# Altium schematic sheet Amplifiers_DAC.SchDoc
size 508 x 482 mm
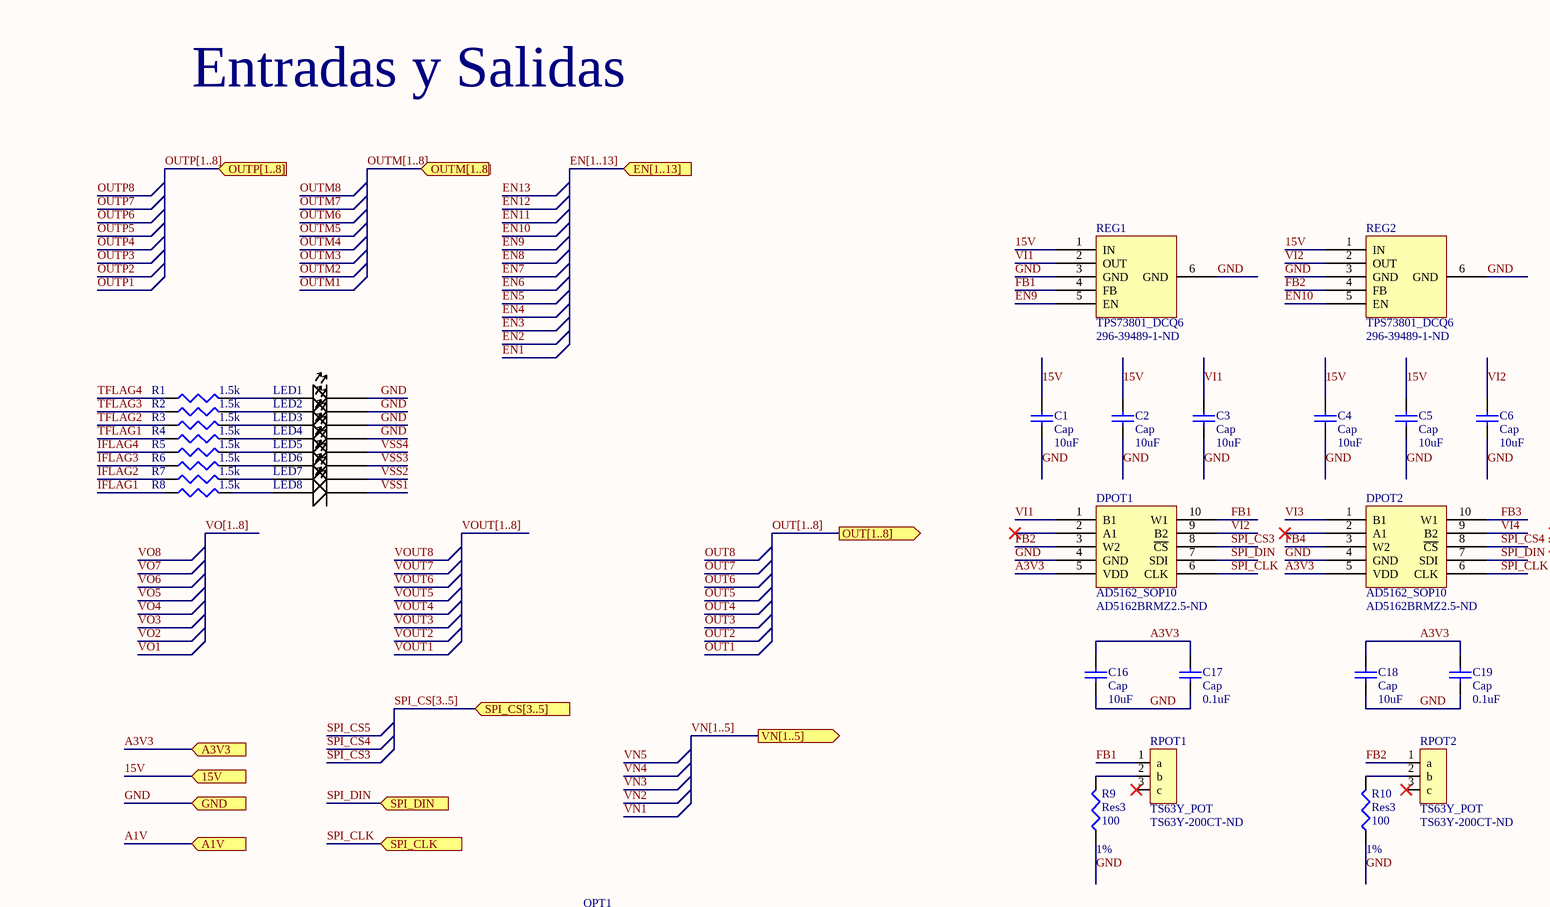
[diagram p0: Amplifiers_DAC.SchDoc, top left]
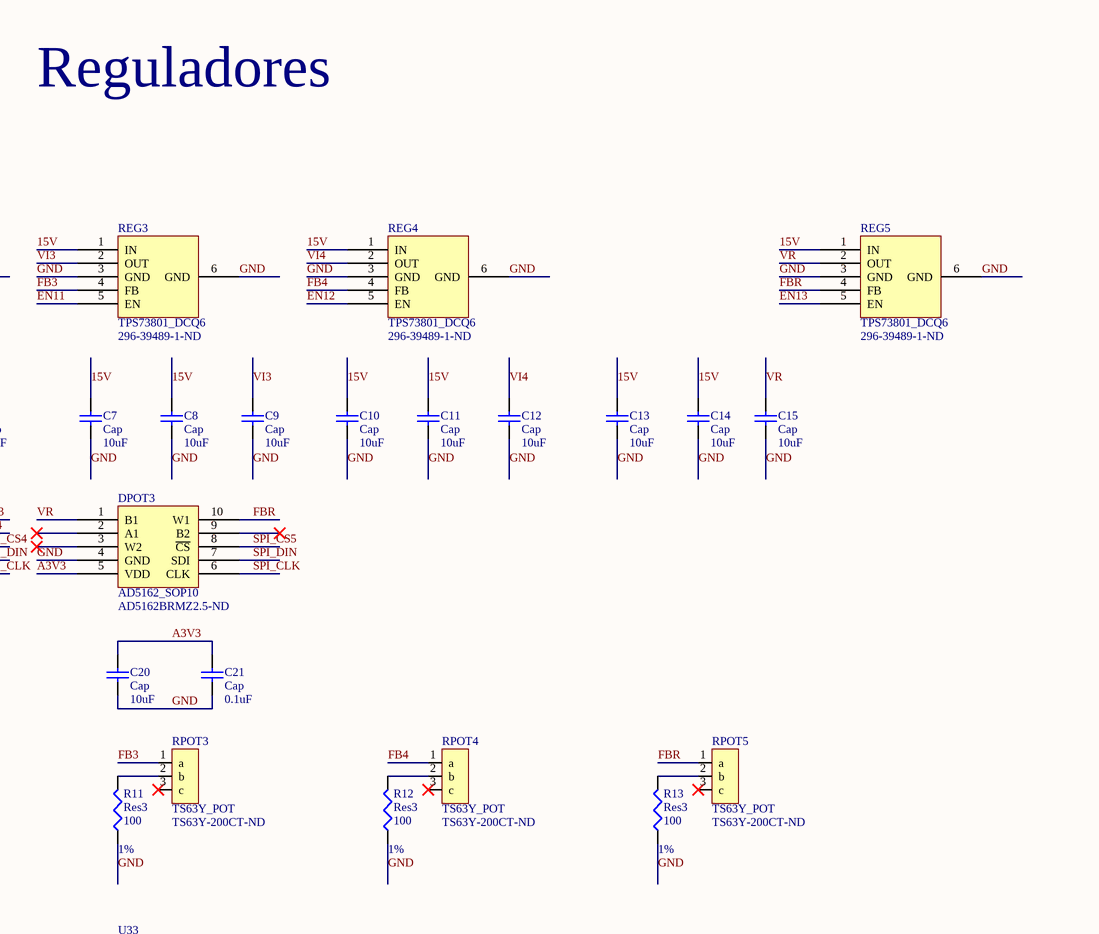
[diagram p1: Amplifiers_DAC.SchDoc, top right]
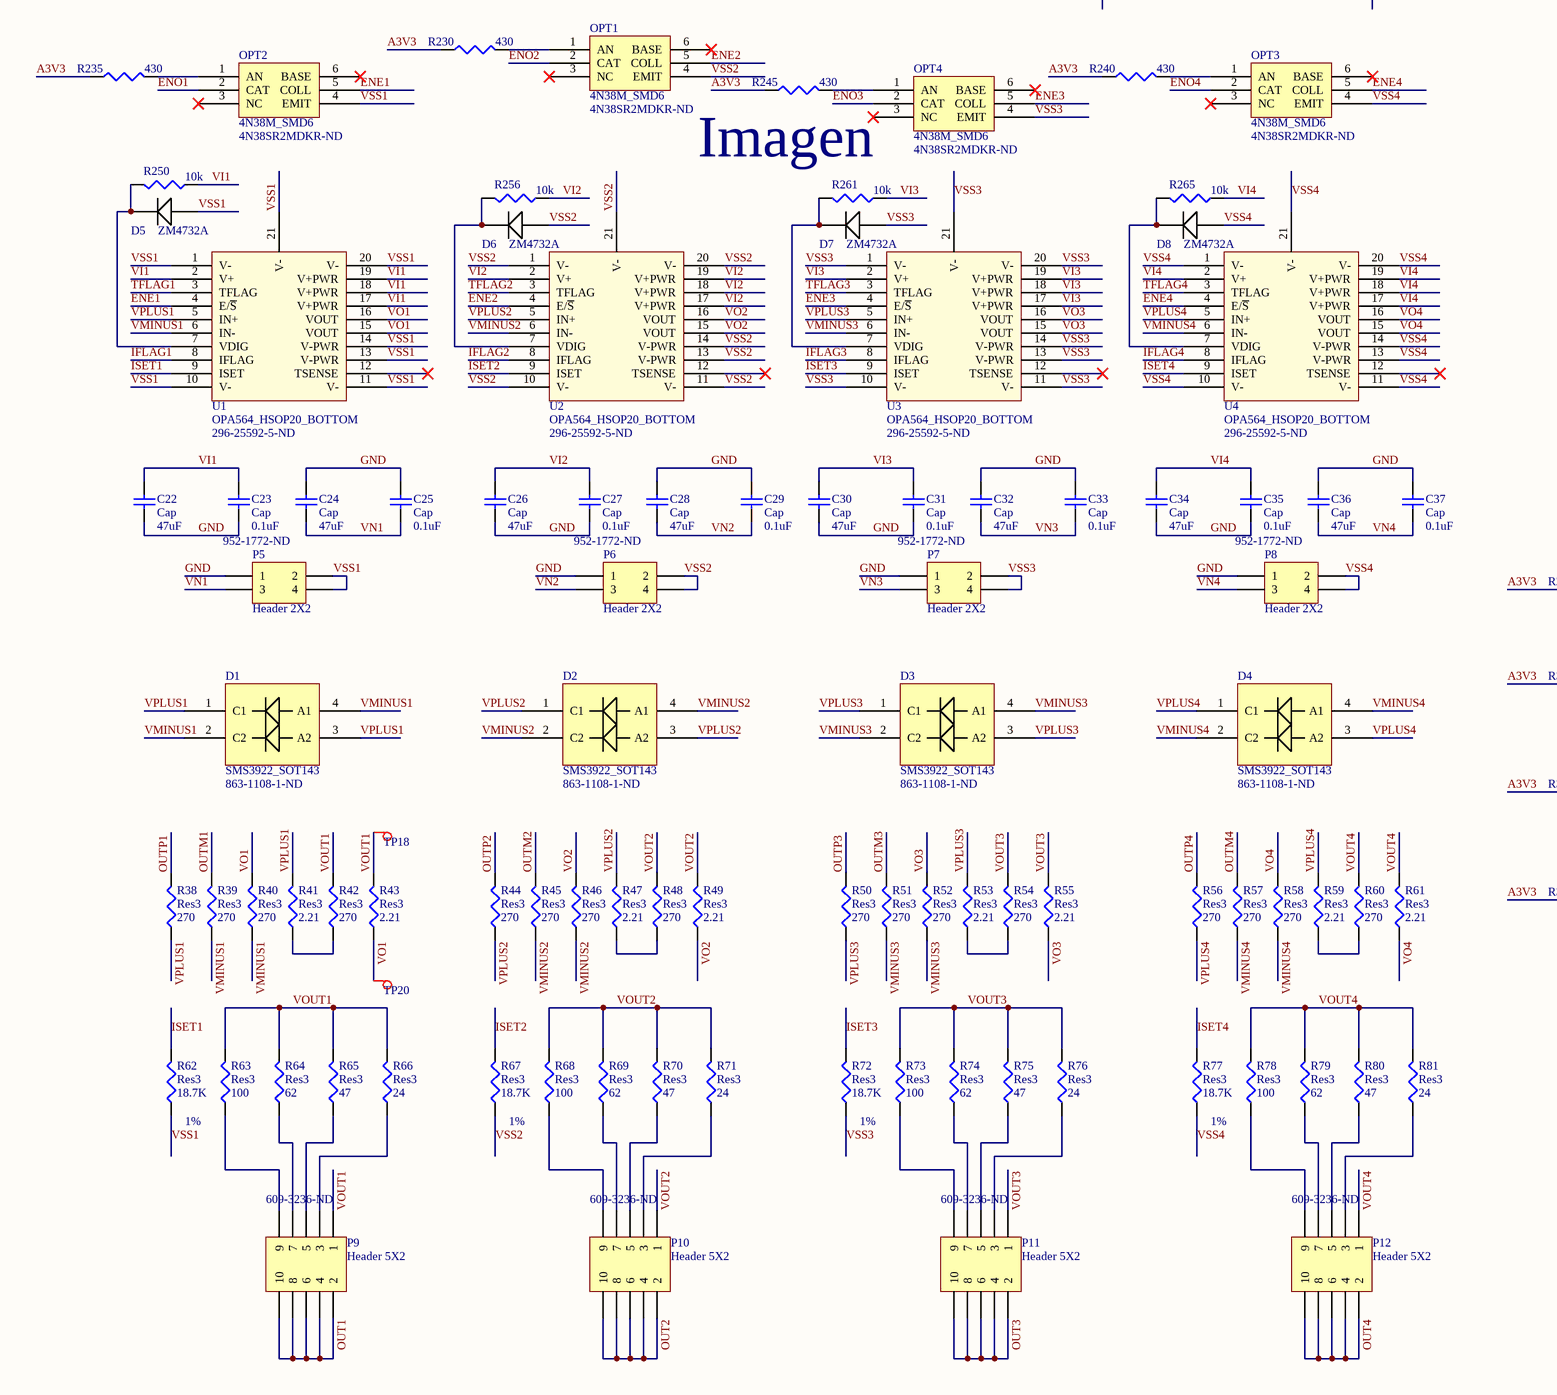
[diagram p2: Amplifiers_DAC.SchDoc, bottom left]
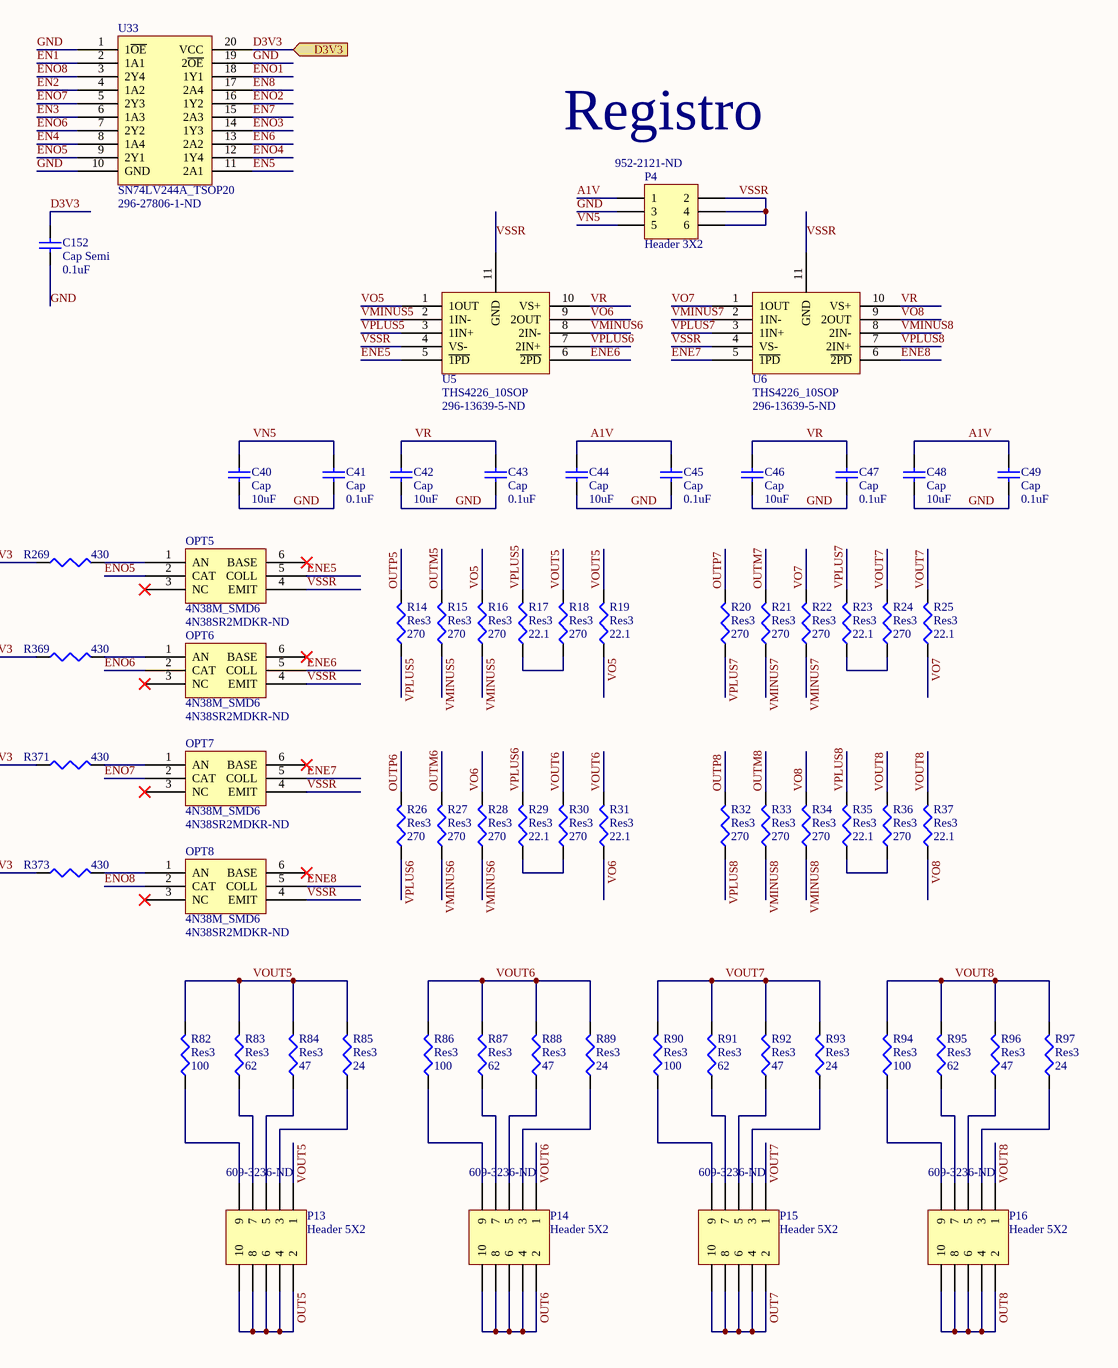
[diagram p3: Amplifiers_DAC.SchDoc, bottom right]

## Parts
C1  Cap  value 10uF  [RES_0805]
C2  Cap  value 10uF  [RES_0805]
C3  Cap  value 10uF  [RES_0805]
C4  Cap  value 10uF  [RES_0805]
C5  Cap  value 10uF  [RES_0805]
C6  Cap  value 10uF  [RES_0805]
C7  Cap  value 10uF  [RES_0805]
C8  Cap  value 10uF  [RES_0805]
C9  Cap  value 10uF  [RES_0805]
C10  Cap  value 10uF  [RES_0805]
C11  Cap  value 10uF  [RES_0805]
C12  Cap  value 10uF  [RES_0805]
C13  Cap  value 10uF  [RES_0805]
C14  Cap  value 10uF  [RES_0805]
C15  Cap  value 10uF  [RES_0805]
C16  Cap  value 10uF  [RES_0805]
C17  Cap  value 0.1uF  [J1-0603]
C18  Cap  value 10uF  [RES_0805]
C19  Cap  value 0.1uF  [J1-0603]
C20  Cap  value 10uF  [RES_0805]
C21  Cap  value 0.1uF  [J1-0603]
C22  Cap  value 47uF  [RES_1206]
C23  Cap  value 0.1uF  [J1-0603]
C24  Cap  value 47uF  [RES_1206]
C25  Cap  value 0.1uF  [J1-0603]
C26  Cap  value 47uF  [RES_1206]
C27  Cap  value 0.1uF  [J1-0603]
C28  Cap  value 47uF  [RES_1206]
C29  Cap  value 0.1uF  [J1-0603]
C30  Cap  value 47uF  [RES_1206]
C31  Cap  value 0.1uF  [J1-0603]
C32  Cap  value 47uF  [RES_1206]
C33  Cap  value 0.1uF  [J1-0603]
C34  Cap  value 47uF  [RES_1206]
C35  Cap  value 0.1uF  [J1-0603]
C36  Cap  value 47uF  [RES_1206]
C37  Cap  value 0.1uF  [J1-0603]
C40  Cap  value 10uF  [RES_0805]
C41  Cap  value 0.1uF  [J1-0603]
C42  Cap  value 10uF  [RES_0805]
C43  Cap  value 0.1uF  [J1-0603]
C44  Cap  value 10uF  [RES_0805]
C45  Cap  value 0.1uF  [J1-0603]
C46  Cap  value 10uF  [RES_0805]
C47  Cap  value 0.1uF  [J1-0603]
C48  Cap  value 10uF  [RES_0805]
C49  Cap  value 0.1uF  [J1-0603]
C152  Cap Semi  value 0.1uF  [J1-0603]
D1  SMS3922_SOT143  Supplier Part Number 1: 863-1108-1-ND  [SMS3922_SOT143]
D2  SMS3922_SOT143  Supplier Part Number 1: 863-1108-1-ND  [SMS3922_SOT143]
D3  SMS3922_SOT143  Supplier Part Number 1: 863-1108-1-ND  [SMS3922_SOT143]
D4  SMS3922_SOT143  Supplier Part Number 1: 863-1108-1-ND  [SMS3922_SOT143]
D5  ZM4732A  [ZM4732A]
D6  ZM4732A  [ZM4732A]
D7  ZM4732A  [ZM4732A]
D8  ZM4732A  [ZM4732A]
DPOT1  AD5162_SOP10  Supplier Part Number 1: AD5162BRMZ2.5-ND  [AD5162_SOP10]
DPOT2  AD5162_SOP10  Supplier Part Number 1: AD5162BRMZ2.5-ND  [AD5162_SOP10]
DPOT3  AD5162_SOP10  Supplier Part Number 1: AD5162BRMZ2.5-ND  [AD5162_SOP10]
LED1  LED  [LED]  (value not drawn)
LED2  LED  [LED]  (value not drawn)
LED3  LED  [LED]  (value not drawn)
LED4  LED  [LED]  (value not drawn)
LED5  LED  [LED]  (value not drawn)
LED6  LED  [LED]  (value not drawn)
LED7  LED  [LED]  (value not drawn)
LED8  LED  [LED]  (value not drawn)
OPT1  4N38M_SMD6  Supplier Part Number 1: 4N38SR2MDKR-ND  [4N38M_SMD6]
OPT2  4N38M_SMD6  Supplier Part Number 1: 4N38SR2MDKR-ND  [4N38M_SMD6]
OPT3  4N38M_SMD6  Supplier Part Number 1: 4N38SR2MDKR-ND  [4N38M_SMD6]
OPT4  4N38M_SMD6  Supplier Part Number 1: 4N38SR2MDKR-ND  [4N38M_SMD6]
OPT5  4N38M_SMD6  Supplier Part Number 1: 4N38SR2MDKR-ND  [4N38M_SMD6]
OPT6  4N38M_SMD6  Supplier Part Number 1: 4N38SR2MDKR-ND  [4N38M_SMD6]
OPT7  4N38M_SMD6  Supplier Part Number 1: 4N38SR2MDKR-ND  [4N38M_SMD6]
OPT8  4N38M_SMD6  Supplier Part Number 1: 4N38SR2MDKR-ND  [4N38M_SMD6]
P4  Header 3X2  Supplier Part Number 1: 952-2121-ND  [HDR2X3]
P5  Header 2X2  Supplier Part Number 1: 952-1772-ND  [HDR2X2]
P6  Header 2X2  Supplier Part Number 1: 952-1772-ND  [HDR2X2]
P7  Header 2X2  Supplier Part Number 1: 952-1772-ND  [HDR2X2]
P8  Header 2X2  Supplier Part Number 1: 952-1772-ND  [HDR2X2]
P9  Header 5X2  Supplier Part Number 1: 609-3236-ND  [HDR2X5]
P10  Header 5X2  Supplier Part Number 1: 609-3236-ND  [HDR2X5]
P11  Header 5X2  Supplier Part Number 1: 609-3236-ND  [HDR2X5]
P12  Header 5X2  Supplier Part Number 1: 609-3236-ND  [HDR2X5]
P13  Header 5X2  Supplier Part Number 1: 609-3236-ND  [HDR2X5]
P14  Header 5X2  Supplier Part Number 1: 609-3236-ND  [HDR2X5]
P15  Header 5X2  Supplier Part Number 1: 609-3236-ND  [HDR2X5]
P16  Header 5X2  Supplier Part Number 1: 609-3236-ND  [HDR2X5]
R1  value 1.5k  [J1-0603]  (hidden comment: Res3)
R2  value 1.5k  [J1-0603]  (hidden comment: Res3)
R3  value 1.5k  [J1-0603]  (hidden comment: Res3)
R4  value 1.5k  [J1-0603]  (hidden comment: Res3)
R5  value 1.5k  [J1-0603]  (hidden comment: Res3)
R6  value 1.5k  [J1-0603]  (hidden comment: Res3)
R7  value 1.5k  [J1-0603]  (hidden comment: Res3)
R8  value 1.5k  [J1-0603]  (hidden comment: Res3)
R9  Res3  value 100  Tol: 1%  [J1-0603]
R10  Res3  value 100  Tol: 1%  [J1-0603]
R11  Res3  value 100  Tol: 1%  [J1-0603]
R12  Res3  value 100  Tol: 1%  [J1-0603]
R13  Res3  value 100  Tol: 1%  [J1-0603]
R14  Res3  value 270  [RES_1206]
R15  Res3  value 270  [RES_1206]
R16  Res3  value 270  [RES_1206]
R17  Res3  value 22.1  [RES_0805]
R18  Res3  value 270  [RES_1206]
R19  Res3  value 22.1  [RES_0805]
R20  Res3  value 270  [RES_1206]
R21  Res3  value 270  [RES_1206]
R22  Res3  value 270  [RES_1206]
R23  Res3  value 22.1  [RES_0805]
R24  Res3  value 270  [RES_1206]
R25  Res3  value 22.1  [RES_0805]
R26  Res3  value 270  [RES_1206]
R27  Res3  value 270  [RES_1206]
R28  Res3  value 270  [RES_1206]
R29  Res3  value 22.1  [RES_0805]
R30  Res3  value 270  [RES_1206]
R31  Res3  value 22.1  [RES_0805]
R32  Res3  value 270  [RES_1206]
R33  Res3  value 270  [RES_1206]
R34  Res3  value 270  [RES_1206]
R35  Res3  value 22.1  [RES_0805]
R36  Res3  value 270  [RES_1206]
R37  Res3  value 22.1  [RES_0805]
R38  Res3  value 270  [RES_1206]
R39  Res3  value 270  [RES_1206]
R40  Res3  value 270  [RES_1206]
R41  Res3  value 2.21  [J1-0603]
R42  Res3  value 270  [RES_1206]
R43  Res3  value 2.21  [J1-0603]
R44  Res3  value 270  [RES_1206]
R45  Res3  value 270  [RES_1206]
R46  Res3  value 270  [RES_1206]
R47  Res3  value 2.21  [J1-0603]
R48  Res3  value 270  [RES_1206]
R49  Res3  value 2.21  [J1-0603]
R50  Res3  value 270  [RES_1206]
R51  Res3  value 270  [RES_1206]
R52  Res3  value 270  [RES_1206]
R53  Res3  value 2.21  [J1-0603]
R54  Res3  value 270  [RES_1206]
R55  Res3  value 2.21  [J1-0603]
R56  Res3  value 270  [RES_1206]
R57  Res3  value 270  [RES_1206]
R58  Res3  value 270  [RES_1206]
R59  Res3  value 2.21  [J1-0603]
R60  Res3  value 270  [RES_1206]
R61  Res3  value 2.21  [J1-0603]
R62  Res3  value 18.7K  Tol: 1%  [RES_1206]
R63  Res3  value 100  [RES_2010]
R64  Res3  value 62  [RES_1206]
R65  Res3  value 47  [RES_0805]
R66  Res3  value 24  [J1-0603]
R67  Res3  value 18.7K  Tol: 1%  [RES_1206]
R68  Res3  value 100  [RES_2010]
R69  Res3  value 62  [RES_1206]
R70  Res3  value 47  [RES_0805]
R71  Res3  value 24  [J1-0603]
R72  Res3  value 18.7K  Tol: 1%  [RES_1206]
R73  Res3  value 100  [RES_2010]
R74  Res3  value 62  [RES_1206]
R75  Res3  value 47  [RES_0805]
R76  Res3  value 24  [J1-0603]
R77  Res3  value 18.7K  Tol: 1%  [RES_1206]
R78  Res3  value 100  [RES_2010]
R79  Res3  value 62  [RES_1206]
R80  Res3  value 47  [RES_0805]
R81  Res3  value 24  [J1-0603]
R82  Res3  value 100  [RES_2010]
R83  Res3  value 62  [RES_1206]
R84  Res3  value 47  [RES_0805]
R85  Res3  value 24  [J1-0603]
R86  Res3  value 100  [RES_2010]
R87  Res3  value 62  [RES_1206]
R88  Res3  value 47  [RES_0805]
R89  Res3  value 24  [J1-0603]
R90  Res3  value 100  [RES_2010]
R91  Res3  value 62  [RES_1206]
R92  Res3  value 47  [RES_0805]
R93  Res3  value 24  [J1-0603]
R94  Res3  value 100  [RES_2010]
R95  Res3  value 62  [RES_1206]
R96  Res3  value 47  [RES_0805]
R97  Res3  value 24  [J1-0603]
R230  value 430  [J1-0603]  (hidden comment: Res3)
R235  value 430  [J1-0603]  (hidden comment: Res3)
R240  value 430  [J1-0603]  (hidden comment: Res3)
R245  value 430  [J1-0603]  (hidden comment: Res3)
R250  value 10k  [J1-0603]  (hidden comment: Res3)
R256  value 10k  [J1-0603]  (hidden comment: Res3)
R261  value 10k  [J1-0603]  (hidden comment: Res3)
R265  value 10k  [J1-0603]  (hidden comment: Res3)
R269  value 430  [J1-0603]  (hidden comment: Res3)
R369  value 430  [J1-0603]  (hidden comment: Res3)
R371  value 430  [J1-0603]  (hidden comment: Res3)
R373  value 430  [J1-0603]  (hidden comment: Res3)
REG1  TPS73801_DCQ6  Supplier Part Number 1: 296-39489-1-ND  [TPS73801_DCQ6]
REG2  TPS73801_DCQ6  Supplier Part Number 1: 296-39489-1-ND  [TPS73801_DCQ6]
REG3  TPS73801_DCQ6  Supplier Part Number 1: 296-39489-1-ND  [TPS73801_DCQ6]
REG4  TPS73801_DCQ6  Supplier Part Number 1: 296-39489-1-ND  [TPS73801_DCQ6]
REG5  TPS73801_DCQ6  Supplier Part Number 1: 296-39489-1-ND  [TPS73801_DCQ6]
RPOT1  TS63Y_POT  Supplier Part Number 1: TS63Y-200CT-ND  [TS63Y_POT]
RPOT2  TS63Y_POT  Supplier Part Number 1: TS63Y-200CT-ND  [TS63Y_POT]
RPOT3  TS63Y_POT  Supplier Part Number 1: TS63Y-200CT-ND  [TS63Y_POT]
RPOT4  TS63Y_POT  Supplier Part Number 1: TS63Y-200CT-ND  [TS63Y_POT]
RPOT5  TS63Y_POT  Supplier Part Number 1: TS63Y-200CT-ND  [TS63Y_POT]
TP18  Test Point  [TestPoint]  (value not drawn)
TP20  Test Point  [TestPoint]  (value not drawn)
U1  OPA564_HSOP20_BOTTOM  Supplier Part Number 1: 296-25592-5-ND  [OPA564_HSOP20_BOTTOM]
U2  OPA564_HSOP20_BOTTOM  Supplier Part Number 1: 296-25592-5-ND  [OPA564_HSOP20_BOTTOM]
U3  OPA564_HSOP20_BOTTOM  Supplier Part Number 1: 296-25592-5-ND  [OPA564_HSOP20_BOTTOM]
U4  OPA564_HSOP20_BOTTOM  Supplier Part Number 1: 296-25592-5-ND  [OPA564_HSOP20_BOTTOM]
U5  THS4226_10SOP  Supplier Part Number 1: 296-13639-5-ND  [THS4226_10SOP]
U6  THS4226_10SOP  Supplier Part Number 1: 296-13639-5-ND  [THS4226_10SOP]
U33  SN74LV244A_TSOP20  Supplier Part Number 1: 296-27806-1-ND  [SN74LV244A_TSOP20]

## Ports
15V (in), A1V (in), A3V3 (in), D3V3 (in), EN[1..13] (in), GND (in), OUT[1..8] (out), OUTM[1..8] (in), OUTP[1..8] (in), SPI_CLK (in), SPI_CS[3..5] (in), SPI_DIN (in), VN[1..5] (out)

## Nets
15V: C1.2 C2.2 C4.2 C5.2 C7.2 C8.2 C10.2 C11.2 C13.2 C14.2 REG1.1(IN) REG2.1(IN) REG3.1(IN) REG4.1(IN) REG5.1(IN) ; port 15V
A1V: C44.2 C45.2 C48.2 C49.2 P4.1 ; port A1V
A3V3: C16.2 C17.2 C18.2 C19.2 C20.2 C21.2 DPOT1.5(VDD) DPOT2.5(VDD) DPOT3.5(VDD) R230.1 R235.1 R240.1 R245.1 R269.1 R369.1 R371.1 R373.1 ; port A3V3
D3V3: C152.2 U33.20(VCC) ; port D3V3
EN1: U33.2(1A1)
EN2: U33.4(1A2)
EN3: U33.6(1A3)
EN4: U33.8(1A4)
EN5: U33.11(2A1)
EN6: U33.13(2A2)
EN7: U33.15(2A3)
EN8: U33.17(2A4)
EN9: REG1.5(EN)
EN10: REG2.5(EN)
EN11: REG3.5(EN)
EN12: REG4.5(EN)
EN13: REG5.5(EN)
ENE1: OPT2.5(COLL) U1.4(E/~{S})
ENE2: OPT1.5(COLL) U2.4(E/~{S})
ENE3: OPT4.5(COLL) U3.4(E/~{S})
ENE4: OPT3.5(COLL) U4.4(E/~{S})
ENE5: OPT5.5(COLL) U5.5(~{1PD})
ENE6: OPT6.5(COLL) U5.6(~{2PD})
ENE7: OPT7.5(COLL) U6.5(~{1PD})
ENE8: OPT8.5(COLL) U6.6(~{2PD})
ENO1: OPT2.2(CAT) U33.18(1Y1)
ENO2: OPT1.2(CAT) U33.16(1Y2)
ENO3: OPT4.2(CAT) U33.14(1Y3)
ENO4: OPT3.2(CAT) U33.12(1Y4)
ENO5: OPT5.2(CAT) U33.9(2Y1)
ENO6: OPT6.2(CAT) U33.7(2Y2)
ENO7: OPT7.2(CAT) U33.5(2Y3)
ENO8: OPT8.2(CAT) U33.3(2Y4)
FB1: DPOT1.10(W1) REG1.4(FB) RPOT1.1(a)
FB2: DPOT1.3(W2) REG2.4(FB) RPOT2.1(a)
FB3: DPOT2.10(W1) REG3.4(FB) RPOT3.1(a)
FB4: DPOT2.3(W2) REG4.4(FB) RPOT4.1(a)
FBR: DPOT3.10(W1) REG5.4(FB) RPOT5.1(a)
GND: C1.1 C2.1 C3.1 C4.1 C5.1 C6.1 C7.1 C8.1 C9.1 C10.1 C11.1 C12.1 C13.1 C14.1 C15.1 C16.1 C17.1 C18.1 C19.1 C20.1 C21.1 C22.1 C23.1 C24.2 C25.2 C26.1 C27.1 C28.2 C29.2 C30.1 C31.1 C32.2 C33.2 C34.1 C35.1 C36.2 C37.2 C40.1 C41.1 C42.1 C43.1 C44.1 C45.1 C46.1 C47.1 C48.1 C49.1 C152.1 DPOT1.4(GND) DPOT2.4(GND) DPOT3.4(GND) LED1.2 LED2.2 LED3.2 LED4.2 P4.3 P5.1 P6.1 P7.1 P8.1 R9.1 R10.1 R11.1 R12.1 R13.1 REG1.3(GND) REG1.6(GND) REG2.3(GND) REG2.6(GND) REG3.3(GND) REG3.6(GND) REG4.3(GND) REG4.6(GND) REG5.3(GND) REG5.6(GND) U33.1(1~{OE}) U33.10(GND) U33.19(2~{OE}) ; port GND
IFLAG1: R8.1 U1.8(IFLAG)
IFLAG2: R7.1 U2.8(IFLAG)
IFLAG3: R6.1 U3.8(IFLAG)
IFLAG4: R5.1 U4.8(IFLAG)
ISET1: R62.2 U1.9(ISET)
ISET2: R67.2 U2.9(ISET)
ISET3: R72.2 U3.9(ISET)
ISET4: R77.2 U4.9(ISET)
OUT1: P9.2 P9.4 P9.6 P9.8 P9.10
OUT2: P10.2 P10.4 P10.6 P10.8 P10.10
OUT3: P11.2 P11.4 P11.6 P11.8 P11.10
OUT4: P12.2 P12.4 P12.6 P12.8 P12.10
OUT5: P13.2 P13.4 P13.6 P13.8 P13.10
OUT6: P14.2 P14.4 P14.6 P14.8 P14.10
OUT7: P15.2 P15.4 P15.6 P15.8 P15.10
OUT8: P16.2 P16.4 P16.6 P16.8 P16.10
OUTM1: R39.2
OUTM2: R45.2
OUTM3: R51.2
OUTM4: R57.2
OUTM5: R15.2
OUTM6: R27.2
OUTM7: R21.2
OUTM8: R33.2
OUTP1: R38.2
OUTP2: R44.2
OUTP3: R50.2
OUTP4: R56.2
OUTP5: R14.2
OUTP6: R26.2
OUTP7: R20.2
OUTP8: R32.2
SPI_CLK: DPOT1.6(CLK) DPOT2.6(CLK) DPOT3.6(CLK) ; port SPI_CLK
SPI_CS3: DPOT1.8(~{CS})
SPI_CS4: DPOT2.8(~{CS})
SPI_CS5: DPOT3.8(~{CS})
SPI_DIN: DPOT1.7(SDI) DPOT2.7(SDI) DPOT3.7(SDI) ; port SPI_DIN
TFLAG1: R4.1 U1.3(TFLAG)
TFLAG2: R3.1 U2.3(TFLAG)
TFLAG3: R2.1 U3.3(TFLAG)
TFLAG4: R1.1 U4.3(TFLAG)
VI1: C3.2 C22.2 C23.2 DPOT1.1(B1) R250.1 REG1.2(OUT) U1.2(V+) U1.17(V+PWR) U1.18(V+PWR) U1.19(V+PWR)
VI2: C6.2 C26.2 C27.2 DPOT1.9(B2) R256.1 REG2.2(OUT) U2.2(V+) U2.17(V+PWR) U2.18(V+PWR) U2.19(V+PWR)
VI3: C9.2 C30.2 C31.2 DPOT2.1(B1) R261.1 REG3.2(OUT) U3.2(V+) U3.17(V+PWR) U3.18(V+PWR) U3.19(V+PWR)
VI4: C12.2 C34.2 C35.2 DPOT2.9(B2) R265.1 REG4.2(OUT) U4.2(V+) U4.17(V+PWR) U4.18(V+PWR) U4.19(V+PWR)
VMINUS1: D1.2(C2) D1.4(A1) R39.1 R40.1 U1.6(IN-)
VMINUS2: D2.2(C2) D2.4(A1) R45.1 R46.1 U2.6(IN-)
VMINUS3: D3.2(C2) D3.4(A1) R51.1 R52.1 U3.6(IN-)
VMINUS4: D4.2(C2) D4.4(A1) R57.1 R58.1 U4.6(IN-)
VMINUS5: R15.1 R16.1 U5.2(1IN-)
VMINUS6: R27.1 R28.1 U5.8(2IN-)
VMINUS7: R21.1 R22.1 U6.2(1IN-)
VMINUS8: R33.1 R34.1 U6.8(2IN-)
VN1: C24.1 C25.1 P5.3
VN2: C28.1 C29.1 P6.3
VN3: C32.1 C33.1 P7.3
VN4: C36.1 C37.1 P8.3
VN5: C40.2 C41.2 P4.5
VO1: R40.2 R43.1 TP20.1(TP) U1.15(VOUT) U1.16(VOUT)
VO2: R46.2 R49.1 U2.15(VOUT) U2.16(VOUT)
VO3: R52.2 R55.1 U3.15(VOUT) U3.16(VOUT)
VO4: R58.2 R61.1 U4.15(VOUT) U4.16(VOUT)
VO5: R16.2 R19.1 U5.1(1OUT)
VO6: R28.2 R31.1 U5.9(2OUT)
VO7: R22.2 R25.1 U6.1(1OUT)
VO8: R34.2 R37.1 U6.9(2OUT)
VOUT1: P9.1 R42.2 R43.2 R63.2 R64.2 R65.2 R66.2 TP18.1(TP)
VOUT2: P10.1 R48.2 R49.2 R68.2 R69.2 R70.2 R71.2
VOUT3: P11.1 R54.2 R55.2 R73.2 R74.2 R75.2 R76.2
VOUT4: P12.1 R60.2 R61.2 R78.2 R79.2 R80.2 R81.2
VOUT5: P13.1 R18.2 R19.2 R82.2 R83.2 R84.2 R85.2
VOUT6: P14.1 R30.2 R31.2 R86.2 R87.2 R88.2 R89.2
VOUT7: P15.1 R24.2 R25.2 R90.2 R91.2 R92.2 R93.2
VOUT8: P16.1 R36.2 R37.2 R94.2 R95.2 R96.2 R97.2
VPLUS1: D1.1(C1) D1.3(A2) R38.1 R41.2 U1.5(IN+)
VPLUS2: D2.1(C1) D2.3(A2) R44.1 R47.2 U2.5(IN+)
VPLUS3: D3.1(C1) D3.3(A2) R50.1 R53.2 U3.5(IN+)
VPLUS4: D4.1(C1) D4.3(A2) R56.1 R59.2 U4.5(IN+)
VPLUS5: R14.1 R17.2 U5.3(1IN+)
VPLUS6: R26.1 R29.2 U5.7(2IN+)
VPLUS7: R20.1 R23.2 U6.3(1IN+)
VPLUS8: R32.1 R35.2 U6.7(2IN+)
VR: C15.2 C42.2 C43.2 C46.2 C47.2 DPOT3.1(B1) REG5.2(OUT) U5.10(VS+) U6.10(VS+)
VSS1: D5.1(anodo) LED8.2 OPT2.4(EMIT) P5.2 P5.4 R62.1 U1.1(V-) U1.10(V-) U1.11(V-) U1.13(V-PWR) U1.14(V-PWR) U1.20(V-) U1.21(V-)
VSS2: D6.1(anodo) LED7.2 OPT1.4(EMIT) P6.2 P6.4 R67.1 U2.1(V-) U2.10(V-) U2.11(V-) U2.13(V-PWR) U2.14(V-PWR) U2.20(V-) U2.21(V-)
VSS3: D7.1(anodo) LED6.2 OPT4.4(EMIT) P7.2 P7.4 R72.1 U3.1(V-) U3.10(V-) U3.11(V-) U3.13(V-PWR) U3.14(V-PWR) U3.20(V-) U3.21(V-)
VSS4: D8.1(anodo) LED5.2 OPT3.4(EMIT) P8.2 P8.4 R77.1 U4.1(V-) U4.10(V-) U4.11(V-) U4.13(V-PWR) U4.14(V-PWR) U4.20(V-) U4.21(V-)
VSSR: OPT5.4(EMIT) OPT6.4(EMIT) OPT7.4(EMIT) OPT8.4(EMIT) P4.2 P4.4 P4.6 U5.4(VS-) U5.11(GND) U6.4(VS-) U6.11(GND)
NetD5_2: D5.2(cátodo) R250.2 U1.7(VDIG)
NetD6_2: D6.2(cátodo) R256.2 U2.7(VDIG)
NetD7_2: D7.2(cátodo) R261.2 U3.7(VDIG)
NetD8_2: D8.2(cátodo) R265.2 U4.7(VDIG)
NetLED1_1: LED1.1 R1.2
NetLED2_1: LED2.1 R2.2
NetLED3_1: LED3.1 R3.2
NetLED4_1: LED4.1 R4.2
NetLED5_1: LED5.1 R5.2
NetLED6_1: LED6.1 R6.2
NetLED7_1: LED7.1 R7.2
NetLED8_1: LED8.1 R8.2
NetOPT1_1: OPT1.1(AN) R230.2
NetOPT2_1: OPT2.1(AN) R235.2
NetOPT3_1: OPT3.1(AN) R240.2
NetOPT4_1: OPT4.1(AN) R245.2
NetOPT5_1: OPT5.1(AN) R269.2
NetOPT6_1: OPT6.1(AN) R369.2
NetOPT7_1: OPT7.1(AN) R371.2
NetOPT8_1: OPT8.1(AN) R373.2
NetP9_3: P9.3 R66.1
NetP9_5: P9.5 R65.1
NetP9_7: P9.7 R64.1
NetP9_9: P9.9 R63.1
NetP10_3: P10.3 R71.1
NetP10_5: P10.5 R70.1
NetP10_7: P10.7 R69.1
NetP10_9: P10.9 R68.1
NetP11_3: P11.3 R76.1
NetP11_5: P11.5 R75.1
NetP11_7: P11.7 R74.1
NetP11_9: P11.9 R73.1
NetP12_3: P12.3 R81.1
NetP12_5: P12.5 R80.1
NetP12_7: P12.7 R79.1
NetP12_9: P12.9 R78.1
NetP13_3: P13.3 R85.1
NetP13_5: P13.5 R84.1
NetP13_7: P13.7 R83.1
NetP13_9: P13.9 R82.1
NetP14_3: P14.3 R89.1
NetP14_5: P14.5 R88.1
NetP14_7: P14.7 R87.1
NetP14_9: P14.9 R86.1
NetP15_3: P15.3 R93.1
NetP15_5: P15.5 R92.1
NetP15_7: P15.7 R91.1
NetP15_9: P15.9 R90.1
NetP16_3: P16.3 R97.1
NetP16_5: P16.5 R96.1
NetP16_7: P16.7 R95.1
NetP16_9: P16.9 R94.1
NetR9_2: R9.2 RPOT1.2(b)
NetR10_2: R10.2 RPOT2.2(b)
NetR11_2: R11.2 RPOT3.2(b)
NetR12_2: R12.2 RPOT4.2(b)
NetR13_2: R13.2 RPOT5.2(b)
NetR17_1: R17.1 R18.1
NetR23_1: R23.1 R24.1
NetR29_1: R29.1 R30.1
NetR35_1: R35.1 R36.1
NetR41_1: R41.1 R42.1
NetR47_1: R47.1 R48.1
NetR53_1: R53.1 R54.1
NetR59_1: R59.1 R60.1

Not connected (* = marked no-connect by the designer): DPOT1 2(A1)*; DPOT2 2(A1)*; DPOT3 2(A1)* 3(W2)* 9(B2)*; OPT1 3(NC)* 6(BASE)*; OPT2 3(NC)* 6(BASE)*; OPT3 3(NC)* 6(BASE)*; OPT4 3(NC)* 6(BASE)*; OPT5 3(NC)* 6(BASE)*; OPT6 3(NC)* 6(BASE)*; OPT7 3(NC)* 6(BASE)*; OPT8 3(NC)* 6(BASE)*; RPOT1 3(c)*; RPOT2 3(c)*; RPOT3 3(c)*; RPOT4 3(c)*; RPOT5 3(c)*; U1 12(TSENSE)*; U2 12(TSENSE)*; U3 12(TSENSE)*; U4 12(TSENSE)*

## Buses and harness runs
bus EN[1..13] = port EN[1..13]
bus OUT[1..8] = port OUT[1..8]
bus OUTM[1..8] = port OUTM[1..8]
bus OUTP[1..8] = port OUTP[1..8]
bus SPI_CS[3..5] = port SPI_CS[3..5]
bus VN[1..5] = port VN[1..5]
bus VO[1..8]
bus VOUT[1..8]

## Notes on the sheet
- Entradas y Salidas
- Reguladores
- Imagen
- Registro

## Library data of the parts
C1-C37 C40-C49 C152 = Cap Semi: Capacitor (Semiconductor SIM Model); Published: 8-Jun-2000; LatestRevisionDate: 29-May-2009; LatestRevisionNote: IPC-7351 Footprint Added.; PackageReference: C1206; Publisher: Altium Limited; PackageDescription: Chip Capacitor; Supplier 1: Digi-Key
  C1-C15: Supplier Part Number 1: 490-3886-1-ND
  C16 C18 C20: Supplier Part Number 1: 490-3340-1-ND
  C17 C19 C21 C23 C25 C27 C29 C31 C33 C35 C37 C41 C43 C45 C47 C49 C152: Supplier Part Number 1: 490-1532-1-ND
  C22 C24 C26 C28 C30 C32 C34 C36: Supplier Part Number 1: 445-8047-1-ND
  C40 C42 C44 C46 C48: Supplier Part Number 1: 490-5523-1-ND
P4 = Header 3X2: Header, 3-Pin, Dual row; LatestRevisionDate: 17-Jul-2002; LatestRevisionNote: Re-released for DXP Platform.; Publisher: Altium Limited; Supplier 1: Digi-Key
P5-P8 = Header 2X2: Header, 2-Pin, Dual row; LatestRevisionDate: 17-Jul-2002; LatestRevisionNote: Re-released for DXP Platform.; Publisher: Altium Limited; Supplier 1: Digi-Key
P9-P16 = Header 5X2: Header, 5-Pin, Dual row; LatestRevisionDate: 17-Jul-2002; LatestRevisionNote: Re-released for DXP Platform.; Publisher: Altium Limited; Supplier 1: Digi-Key
R1-R97 R230 R235 R240 R245 R250 R256 R261 R265 R269 R369 R371 R373 = Res3: Resistor; Published: 8-Jun-2000; LatestRevisionDate: 29-May-2009; LatestRevisionNote: IPC-7351 Footprint Added.; PackageReference: J1-0603; Publisher: Altium Limited; PackageDescription: Chip Resistor; Supplier 1: Digi-Key
  R1-R8: Supplier Part Number 1: RMCF0603JT1K50CT-ND
  R9-R13: Supplier Part Number 1: P100HCT-ND
  R14-R16 R18 R20-R22 R24 R26-R28 R30 R32-R34 R36 R38-R40 R42 R44-R46 R48 R50-R52 R54 R56-R58 R60: Supplier Part Number 1: YAG2033CT-ND
  R17 R19 R23 R25 R29 R31 R35 R37: Supplier Part Number 1: A110384CT-ND
  R41 R43 R47 R49 R53 R55 R59 R61: Supplier Part Number 1: RNCF0603BKC2R21CT-ND
  R62 R67 R72 R77: Supplier Part Number 1: P18.7KFCT-ND
  R63 R68 R73 R78 R82 R86 R90 R94: Supplier Part Number 1: RMCP2010JT100RCT-ND
  R64 R69 R74 R79 R83 R87 R91 R95: Supplier Part Number 1: P62ALCT-ND
  R65 R70 R75 R80 R84 R88 R92 R96: Supplier Part Number 1: P16938CT-ND
  R66 R71 R76 R81 R85 R89 R93 R97: Supplier Part Number 1: P24.00BYCT-ND
  R230 R235 R240 R245 R269 R369 R371 R373: Supplier Part Number 1: 311-430HRDKR-ND
  R250 R256 R261 R265: Supplier Part Number 1: 311-10KGRCT-ND
D1-D4 = SMS3922_SOT143: Supplier 1: Digi-Key
D5-D8 = ZM4732A: Supplier 1: Digi-Key; Supplier Part Number 1: ZM4732A-GS08CT-ND
DPOT1-DPOT3 = AD5162_SOP10: Supplier 1: Digi-Key
LED1-LED8 = LED: Supplier 1: Digi-Key; Supplier Part Number 1: 160-1446-1-ND
OPT1-OPT8 = 4N38M_SMD6: Supplier 1: Digi-Key
REG1-REG5 = TPS73801_DCQ6: Supplier 1: Digi-Key
RPOT1-RPOT5 = TS63Y_POT: Supplier 1: Digi-Key
TP18 TP20 = Test Point: Supplier 1: Digi-Key; Supplier Part Number 1: 36-5019CT-ND
U1-U4 = OPA564_HSOP20_BOTTOM: Supplier 1: Digi-Key
U5 U6 = THS4226_10SOP: Supplier 1: Digi-Key
U33 = SN74LV244A_TSOP20: Supplier 1: Digi-Key